# Altium schematic sheet ALU_Ctrl.SchDoc
size A; Author: E. Sims; Organization: Let's Build Rockets Inc.; SheetNumber: 7; SheetTotal: 11
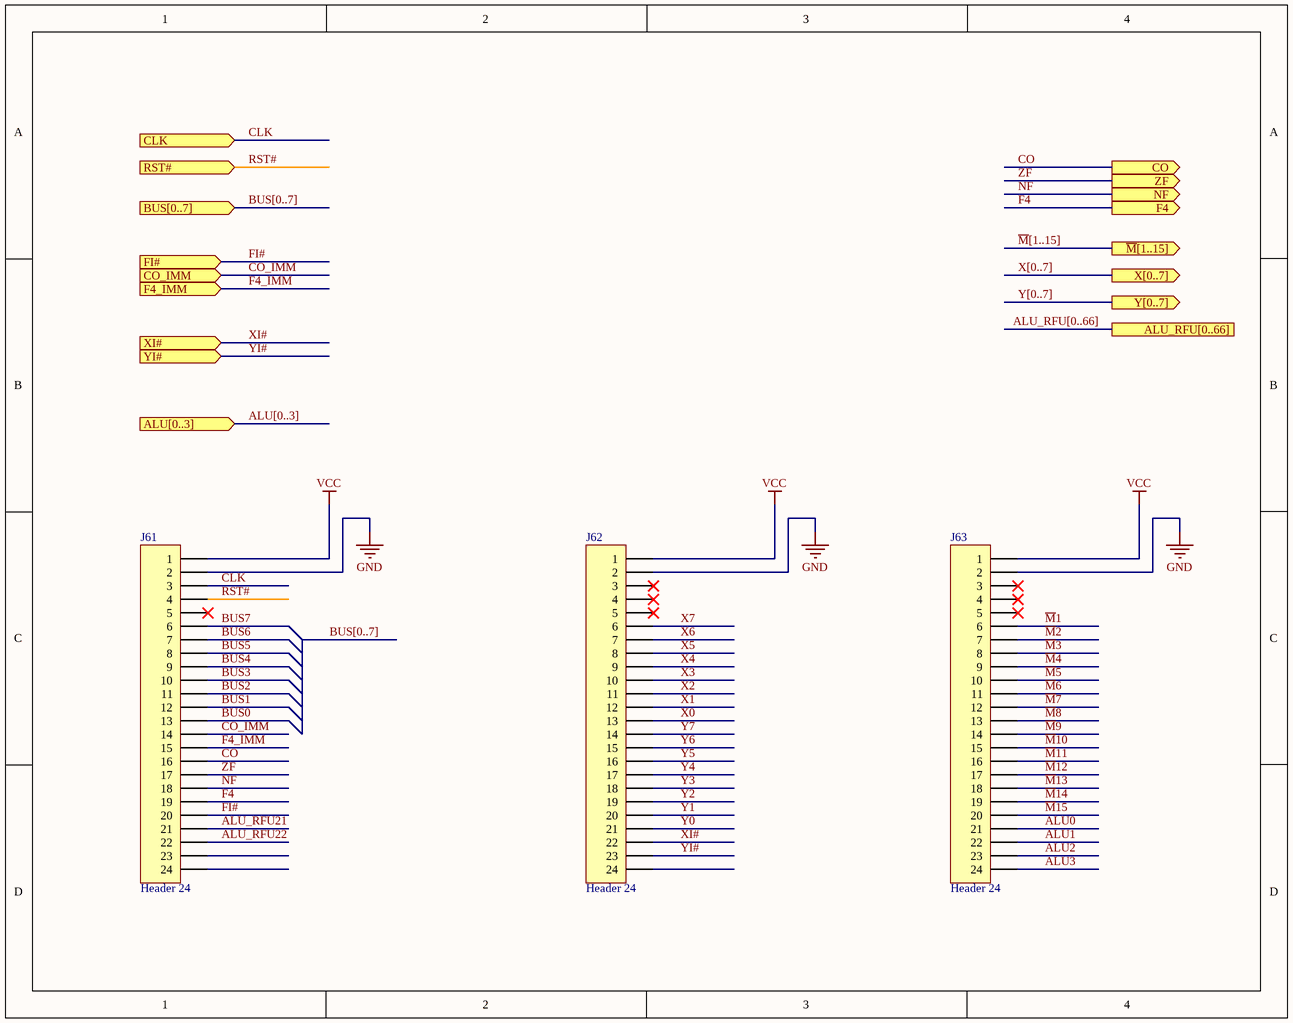
[diagram p0: ALU_Ctrl.SchDoc]

## Parts
J61  Header 24  [HDR1X24]
J62  Header 24  [HDR1X24]
J63  Header 24  [HDR1X24]

## Ports
ALU[0..3] (in), ALU_RFU[0..66], BUS[0..7] (in), CLK (in), CO (out), CO_IMM (in), F4 (out), F4_IMM (in), FI# (in), NF (out), RST# (in), X[0..7] (out), XI# (in), Y[0..7] (out), YI# (in), ZF (out), ~{M}[1..15] (out)

## Nets
GND: J61.2 J62.2 J63.2
VCC: J61.1 J62.1 J63.1
ALU0: J63.21
ALU1: J63.22
ALU2: J63.23
ALU3: J63.24
ALU_RFU21: J61.21
ALU_RFU22: J61.22
BUS0: J61.13
BUS1: J61.12
BUS2: J61.11
BUS3: J61.10
BUS4: J61.9
BUS5: J61.8
BUS6: J61.7
BUS7: J61.6
CLK: J61.3 ; port CLK
CO: J61.16 ; port CO
CO_IMM: J61.14 ; port CO_IMM
F4: J61.19 ; port F4
F4_IMM: J61.15 ; port F4_IMM
FI#: J61.20 ; port FI#
~{M}1: J63.6
~{M}2: J63.7
~{M}3: J63.8
~{M}4: J63.9
~{M}5: J63.10
~{M}6: J63.11
~{M}7: J63.12
~{M}8: J63.13
~{M}9: J63.14
~{M}10: J63.15
~{M}11: J63.16
~{M}12: J63.17
~{M}13: J63.18
~{M}14: J63.19
~{M}15: J63.20
NF: J61.18 ; port NF
RST#: J61.4 ; port RST#
X0: J62.13
X1: J62.12
X2: J62.11
X3: J62.10
X4: J62.9
X5: J62.8
X6: J62.7
X7: J62.6
XI#: J62.22 ; port XI#
Y0: J62.21
Y1: J62.20
Y2: J62.19
Y3: J62.18
Y4: J62.17
Y5: J62.16
Y6: J62.15
Y7: J62.14
YI#: J62.23 ; port YI#
ZF: J61.17 ; port ZF

Not connected (* = marked no-connect by the designer): J61 5* 23 24; J62 3* 4* 5* 24; J63 3* 4* 5*

## Buses and harness runs
bus ALU[0..3] = port ALU[0..3]
bus ALU_RFU[0..66] = port ALU_RFU[0..66]
bus BUS[0..7]
bus BUS[0..7] = port BUS[0..7]
bus X[0..7] = port X[0..7]
bus Y[0..7] = port Y[0..7]
bus ~{M}[1..15] = port ~{M}[1..15]

## Notes on the sheet
- Let's Build Rocket's Inc. Modular Paylaod System Based on TMP-010 Rev
  For more information visit https://github.com/LetsBuildRockets/Modular-Payload-System
  This work is licensed under CC BY-NC 4.0. To view a copy of this license, visit https://creativecommons.org/licenses/by-nc/4.0
- Title
- Size:
- Date:
- Assembly Variant:
- B
- Number:
- Time:
- Revision:
- Sheet
- of
- Author:
- File:

## Library data of the parts
J61-J63 = Header 24: Header, 24-Pin; System: Connector; LatestRevisionDate: 17-Jul-2002; LatestRevisionNote: Re-released for DXP Platform.; Publisher: Altium Limited